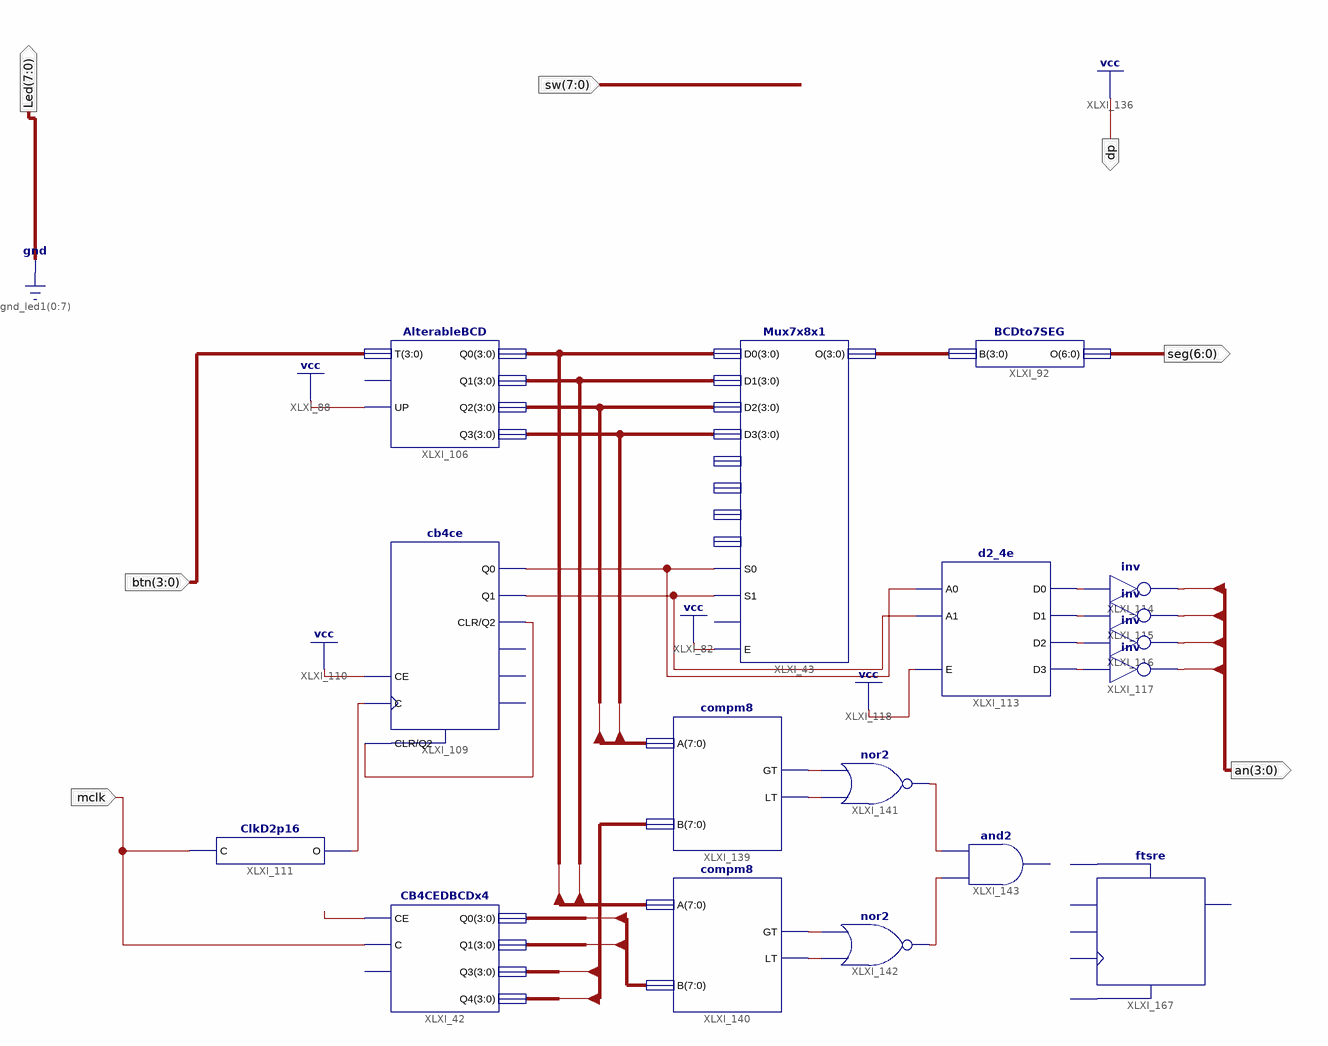
[diagram p0: schematic sheet 1]
// Xilinx ISE schematic Timer.sch (spartan3e) as structural Verilog: 17 symbols, 7 ports
module Timer (
  input  [7:0] sw,
  input  [3:0] btn,
  input  mclk,
  output dp,
  output [7:0] Led,
  output [6:0] seg,
  output [3:0] an
);

  wire XLXN_205, XLXN_221, XLXN_231, XLXN_232, XLXN_238, XLXN_239, XLXN_244, XLXN_245, XLXN_294, XLXN_303,
       XLXN_304, XLXN_305, XLXN_306, XLXN_307, XLXN_308;
  wire [3:0] XLXN_174;
  wire [7:0] XLXN_297, XLXN_298, XLXN_318, XLXN_319;

  BCDto7SEG XLXI_92 (.B(XLXN_174), .O(seg));
  ClkD2p16 XLXI_111 (.C(mclk), .O(XLXN_232));
  d2_4e XLXI_113 (.A0(XLXN_205), .A1(XLXN_221), .E(1'b1), .D0(XLXN_238), .D1(XLXN_239), .D2(XLXN_244), .D3(XLXN_245));
  Mux7x8x1 XLXI_43 (
    .D0(XLXN_298[3:0]), .D1(XLXN_298[7:4]), .D2(XLXN_297[3:0]), .D3(XLXN_297[7:4]), .E(1'b1), .O(XLXN_174),
    .S0(XLXN_205), .S1(XLXN_221));  // open: D4, D5, D6, D7, S2
  not XLXI_114 (an[0], XLXN_238);
  not XLXI_115 (an[1], XLXN_239);
  not XLXI_116 (an[2], XLXN_244);
  not XLXI_117 (an[3], XLXN_245);
  cb4ce XLXI_109 (
    .C(XLXN_232), .CE(1'b1), .CLR(XLXN_231), .Q0(XLXN_205), .Q1(XLXN_221), .Q2(XLXN_231));  // open: CEO, Q3, TC
  AlterableBCD XLXI_106 (
    .Q0(XLXN_298[3:0]), .Q1(XLXN_298[7:4]), .Q2(XLXN_297[3:0]), .Q3(XLXN_297[7:4]), .T(btn), .UP(1'b1));  // open: CLR
  CB4CEDBCDx4 XLXI_42 (
    .C(mclk), .CE(XLXN_294), .Q0(XLXN_318[3:0]), .Q1(XLXN_318[7:4]), .Q3(XLXN_319[3:0]), .Q4(XLXN_319[7:4]));  // open: CLR
  compm8 XLXI_139 (.A(XLXN_297), .B(XLXN_319), .GT(XLXN_303), .LT(XLXN_304));
  compm8 XLXI_140 (.A(XLXN_298), .B(XLXN_318), .GT(XLXN_305), .LT(XLXN_306));
  nor XLXI_141 (XLXN_307, XLXN_304, XLXN_303);
  nor XLXI_142 (XLXN_308, XLXN_306, XLXN_305);
  // and2 XLXI_143 has open pins: I0=XLXN_308, I1=XLXN_307, O=open
  ftsre XLXI_167 ();  // open: C, CE, R, S, T, Q

  assign dp = 1'b1;
  assign Led = {8{1'b0}};
endmodule
